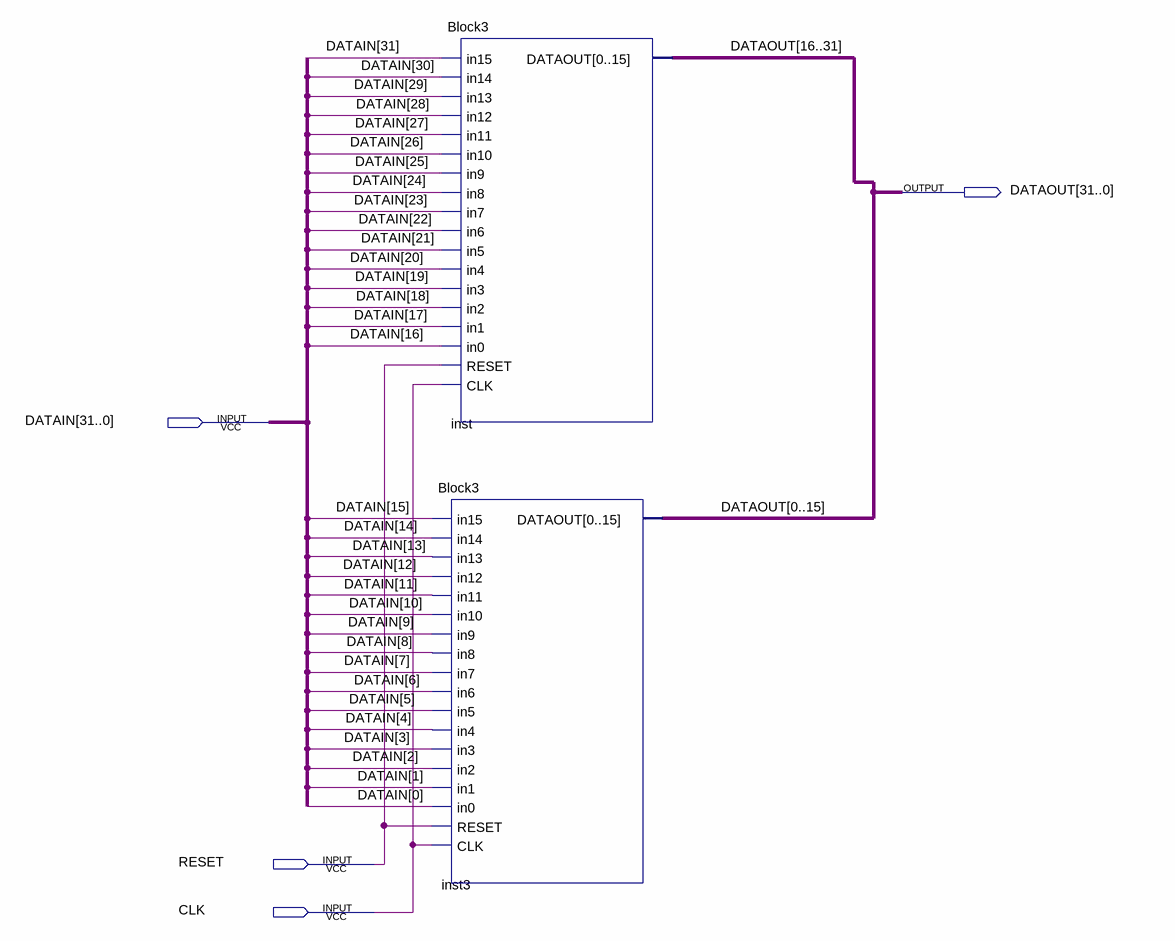
[diagram p0: schematic sheet]
// Quartus schematic 32bits.bdf as structural Verilog: 2 symbols, 4 pins
module \32bits  (
  input  [31:0] DATAIN,
  input  RESET,
  input  CLK,
  output [31:0] DATAOUT
);

  Block3 inst (
    .in15(DATAIN[31]), .in14(DATAIN[30]), .in13(DATAIN[29]), .in12(DATAIN[28]), .in11(DATAIN[27]),
    .in10(DATAIN[26]), .in9(DATAIN[25]), .in8(DATAIN[24]), .in7(DATAIN[23]), .in6(DATAIN[22]),
    .in5(DATAIN[21]), .in4(DATAIN[20]), .in3(DATAIN[19]), .in2(DATAIN[18]), .in1(DATAIN[17]),
    .in0(DATAIN[16]), .RESET(RESET), .CLK(CLK),
    .DATAOUT({DATAOUT[16], DATAOUT[17], DATAOUT[18], DATAOUT[19], DATAOUT[20], DATAOUT[21], DATAOUT[22], DATAOUT[23], DATAOUT[24], DATAOUT[25], DATAOUT[26], DATAOUT[27], DATAOUT[28], DATAOUT[29], DATAOUT[30], DATAOUT[31]}));
  Block3 inst3 (
    .in15(DATAIN[15]), .in14(DATAIN[14]), .in13(DATAIN[13]), .in12(DATAIN[12]), .in11(DATAIN[11]),
    .in10(DATAIN[10]), .in9(DATAIN[9]), .in8(DATAIN[8]), .in7(DATAIN[7]), .in6(DATAIN[6]), .in5(DATAIN[5]),
    .in4(DATAIN[4]), .in3(DATAIN[3]), .in2(DATAIN[2]), .in1(DATAIN[1]), .in0(DATAIN[0]), .RESET(RESET),
    .CLK(CLK),
    .DATAOUT({DATAOUT[0], DATAOUT[1], DATAOUT[2], DATAOUT[3], DATAOUT[4], DATAOUT[5], DATAOUT[6], DATAOUT[7], DATAOUT[8], DATAOUT[9], DATAOUT[10], DATAOUT[11], DATAOUT[12], DATAOUT[13], DATAOUT[14], DATAOUT[15]}));
endmodule
